# EAGLE design MAX3232_Breakout (EAGLE 6.2)
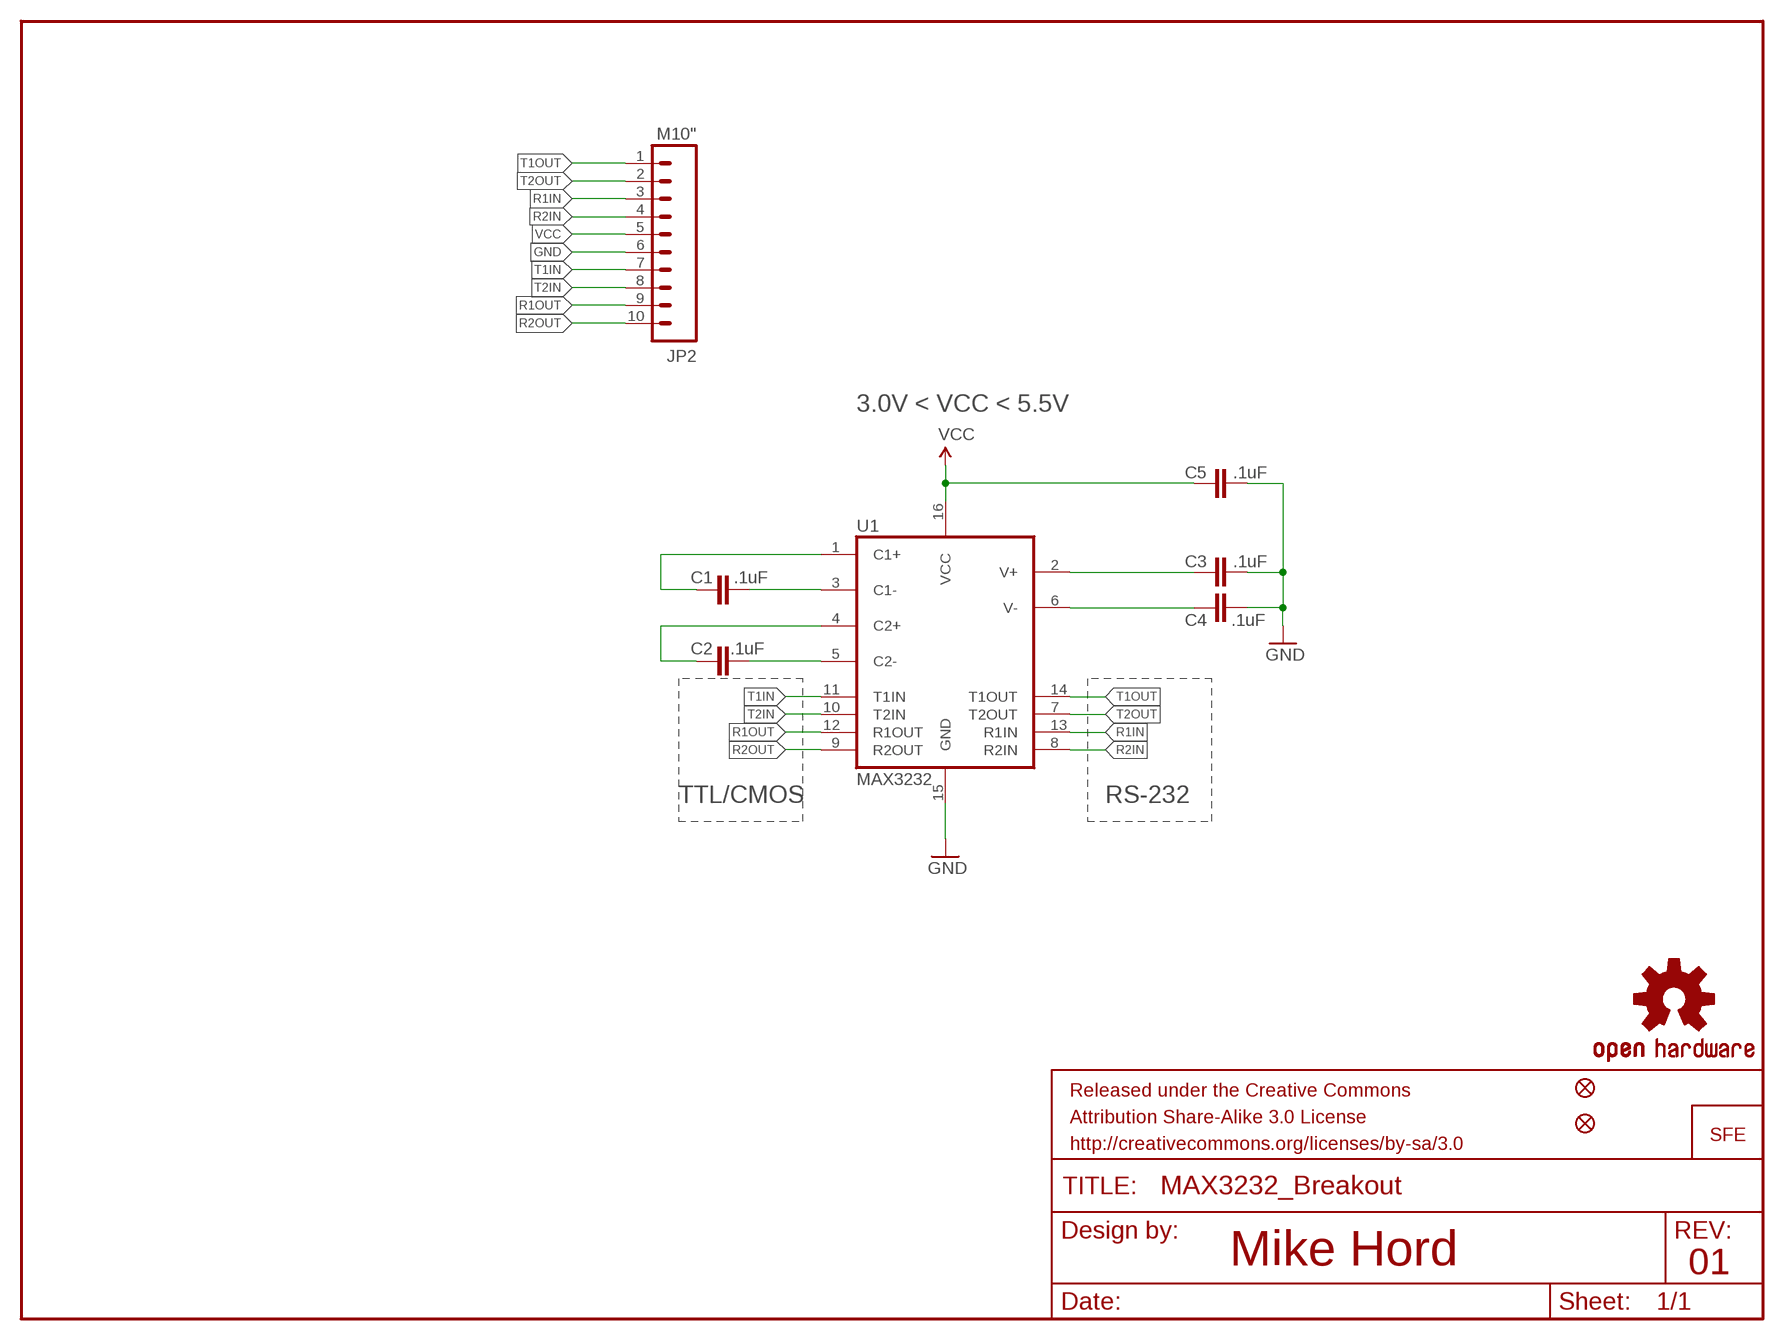
[diagram p0: schematic, sheet 1]

## Parts
C1  .1uF  CAP0402-CAP  [0402-CAP]
C2  .1uF  CAP0402-CAP  [0402-CAP]
C3  .1uF  CAP0402-CAP  [0402-CAP]
C4  .1uF  CAP0402-CAP  [0402-CAP]
C5  .1uF  CAP0402-CAP  [0402-CAP]
FRAME1  FRAME-LETTER  [CREATIVE_COMMONS]
JP1  LOGO-SFESK  [SFE-LOGO-FLAME]
JP2  M10"  [1X10]
JP3  FIDUCIALUFIDUCIAL  [MICRO-FIDUCIAL]
JP4  FIDUCIALUFIDUCIAL  [MICRO-FIDUCIAL]
U1  MAX3232  MAX232SOIC16  [SO016]
U$1  OSHW-LOGOM  [OSHW-LOGO-M]

## Nets
C1+: C1.1 U1.1(C1+)
C1-: C1.2 U1.3(C1-)
C2+: C2.1 U1.4(C2+)
C2-: C2.2 U1.5(C2-)
GND: C3.2 C4.2 C5.2 JP2.6 U1.15(GND)
R1IN: JP2.3 U1.13(R1IN)
R1OUT: JP2.9 U1.12(R1OUT)
R2IN: JP2.4 U1.8(R2IN)
R2OUT: JP2.10 U1.9(R2OUT)
T1IN: JP2.7 U1.11(T1IN)
T1OUT: JP2.1 U1.14(T1OUT)
T2IN: JP2.8 U1.10(T2IN)
T2OUT: JP2.2 U1.7(T2OUT)
V+: C3.1 U1.2(V+)
V-: C4.1 U1.6(V-)
VCC: C5.1 JP2.5 U1.16(VCC)

## Notes on the sheet
- 3.0V < VCC < 5.5V
- TTL/CMOS | RS-232
- Mike Hord | 01

## Library data of the parts
C1-C5 = SparkFun-Passives:CAP: Capacitor Standard 0603 ceramic capacitor, and 0.1" leaded capacitor.; PROD_ID: CAP-00810; SPARKLE_ID: 918
FRAME1 = SparkFun-Aesthetics:FRAME-LETTER: Schematic Frame Standard 8.5x11 US Letter frame; NO_PART: 1
JP1 = SparkFun-Aesthetics:LOGO-SFE: Spark Fun Electronics PCB Logo This is the standard Spark Fun Electronics PCB logo.; NO_PART: 1
JP2 = SparkFun-Connectors:M10: Header 10 Standard 10-pin 0.1" header. Use with straight break away headers (SKU : PRT-00116), right angle break away headers (PRT-00553), swiss pins (PRT-00743), machine pins (PRT-00117), and female headers (PRT-00115).; NO_PART: 1
JP3 JP4 = SparkFun:FIDUCIAL: Fiducial Alignment Points Various fiducial points for machine vision alignment.
U1 = SparkFun-DigitalIC:MAX232: RS232 Transceiver Very common IC. This is generically called 'MAX232', but works with the 3V equivalent MAX3232 generic ICs. Field tested and mother approved. Spark Fun Electronics SKU : COM-00316 (DIP) and COM-00589 (SMD); PROD_ID: IC-08171
U$1 = SparkFun-Aesthetics:OSHW-LOGO: Open Source Hardware Logo This logo indicates the piece of hardware it is found on incorporates a OSHW license and/or adheres to the definition of open source hardware found here: http://freedomdefined.org/OSHW; NO_PART: 1

## Board
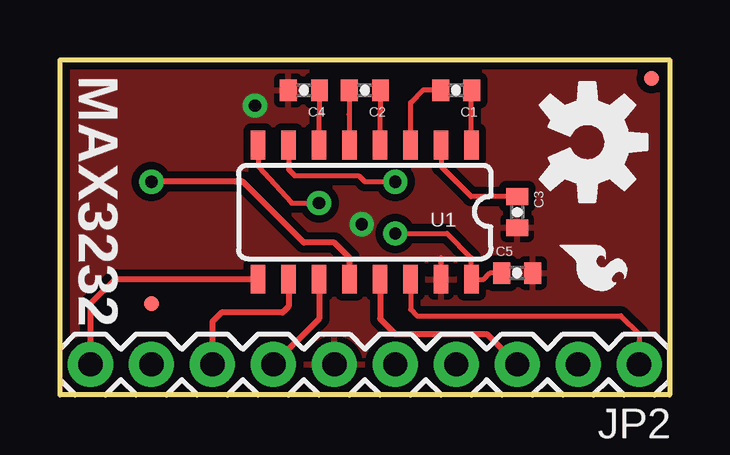
[diagram p1: board, top side]
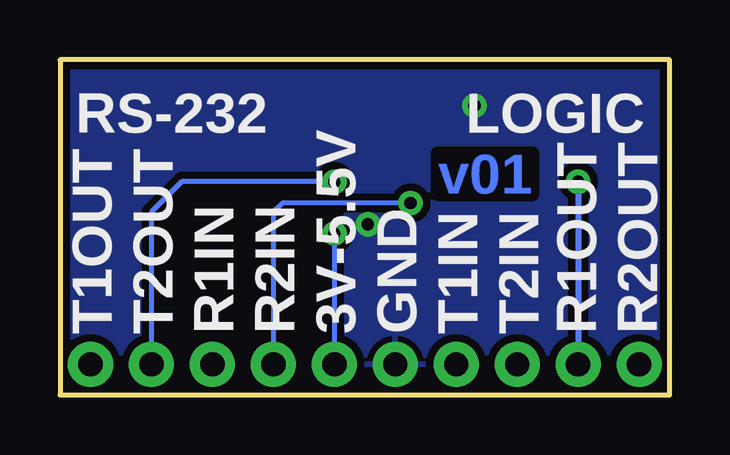
[diagram p2: board, bottom side, seen from below]

Size 25.4 x 13.97 mm. Coordinates in mm from the lower left corner, seen from the top.
Outline: 0,0 0,13.97 25.4,13.97 25.4,0 0,0
Copper layers (1*16): Top 0.035mm / dielectric 1.5mm / Bottom 0.035mm
Design rules: minimum track width 8mil, minimum drill 20mil, track to track 8mil, track to pad 8mil, pad to pad 8mil, via to via 8mil, smd to smd 8mil, copper to edge 8mil, drill to drill 8mil, minimum pad ring 12mil, minimum via ring 10mil, stop-mask expansion 4mil, vias tented up to drill 20mil, thermal gap 10mil

### Footprints (pad centres in the part's own frame; a part is rotated, then mirrored left to right if it is on the bottom)
0402-CAP = smd 0.7 x 0.9: 1 -0.65,0; 2 0.65,0
1X10 = drill 1.016 pad 1.88: 1 0,0; 2 2.54,0; 3 5.08,0; 4 7.62,0; 5 10.16,0; 6 12.7,0; 7 15.24,0; 8 17.78,0; 9 20.32,0; 10 22.86,0
MICRO-FIDUCIAL = smd 0.635 x 0.635: 1 0,0
SO016 = smd 0.6 x 1.2: 1 -4.445,-2.8; 2 -3.175,-2.8; 3 -1.905,-2.8; 4 -0.635,-2.8; 5 0.635,-2.8; 6 1.905,-2.8; 7 3.175,-2.8; 8 4.445,-2.8; 9 4.445,2.8; 10 3.175,2.8; 11 1.905,2.8; 12 0.635,2.8; 13 -0.635,2.8; 14 -1.905,2.8; 15 -3.175,2.8; 16 -4.445,2.8

### Placement (x,y rotation side)
C1  16.51,12.7 180 top
C2  12.7,12.7 180 top
C3  19.05,7.62 270 top
C4  10.16,12.7 180 top
C5  19.05,5.08 0 top
FRAME1  -64.77,0 0 top  (outside the outline)
JP1  20.83,6.22 270 top
JP2  24.13,1.27 180 top
JP3  24.64,13.21 0 top
JP4  3.81,3.81 0 top
U1  12.7,7.62 180 top
U$1  21.97,10.54 270 top

### Tracks (layer width: path | path; a pad name or v marks a point on that pad's centre or on a via)
C1+
  Top 0.203: U1.1 17.14,12.69 C1.1
C1-
  Top 0.203: U1.3 14.61,12.19 15.11,12.7 C1.2
C2+
  Top 0.203: C2.1 13.35,11.83 13.34,11.81 U1.4
C2-
  Top 0.203: C2.2 12.05,11.7 12.06,11.68 U1.5
GND  (via drill 0.51)
  Top 0.203: U1.15 15.88,5.71
  other vias: 12.57,7.11 8.13,12.06
  pour Top (isolate 0.305): 0,13.97 25.4,13.97 25.4,0 0,0
  pour Bottom (isolate 0.305): 0,13.97 25.4,13.97 25.4,0 0,0
R1IN
  Top 0.254: U1.13 13.34,3.17 13.97,2.54 17.78,2.54 JP2.3
R1OUT  (via drill 0.51)
  Top 0.254: U1.12 12.06,5.71 11.43,6.35 10.16,6.35 7.62,8.89 v3.81,8.89
  Bottom 0.254: v3.81,8.89 JP2.9
R2IN  (via drill 0.51)
  Top 0.203: U1.8 8.26,9.53 9.65,8 v10.79,8
  Bottom 0.203: v10.79,8 16.13,8 16.51,7.62 JP2.4
R2OUT
  Top 0.254: U1.9 2.28,4.82 1.27,3.81 JP2.10
T1IN
  Top 0.254: U1.11 10.79,3.17 JP2.7
T1OUT
  Top 0.203: U1.14 14.61,3.56 14.86,3.3 23.37,3.3 24.13,2.54 JP2.1
T2IN
  Top 0.254: U1.10 9.53,3.68 9.27,3.43 6.73,3.43 6.35,3.05 JP2.8
T2OUT  (via drill 0.51)
  Top 0.203: U1.7 9.53,9.4 9.78,9.14 12.45,9.14 12.7,8.89 v13.97,8.89
  Bottom 0.203: v13.97,8.89 20.32,8.89 21.59,7.62 JP2.2
V+
  Top 0.203: U1.2 15.88,9.53 17.13,8.27 C3.1
V-
  Top 0.203: C4.1 10.81,11.7 10.79,11.68 U1.6
VCC  (via drill 0.51)
  Top 0.203: v13.97,6.73 16.13,6.73 17.14,5.71 U1.16 17.65,4.82 17.91,5.08 C5.1
  Bottom 0.203: v13.97,6.73 JP2.5

### Text on the board
Bottom: v01
tPlace: MAX3232
bPlace: LOGIC | RS-232 | R2OUT | R1OUT | T2IN | T1IN | GND | 3V-5.5V | R2IN | R1IN | T2OUT | T1OUT
tValues: Mike Hord